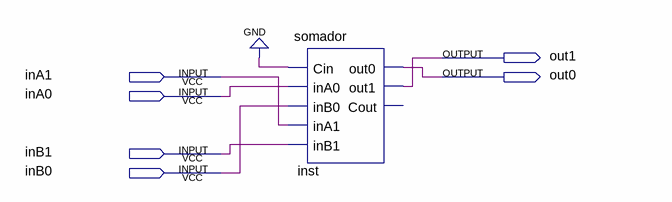
[diagram p0: schematic sheet]
// Quartus schematic alu.bdf as structural Verilog: 1 symbols, 6 pins
module alu (
  input  inA1,
  input  inA0,
  input  inB1,
  input  inB0,
  output out1,
  output out0
);

  somador inst (
    .Cin(1'b0), .inA0(inA0), .inB0(inB0), .inA1(inA1), .inB1(inB1), .out0(out0), .out1(out1));  // open: Cout
endmodule
